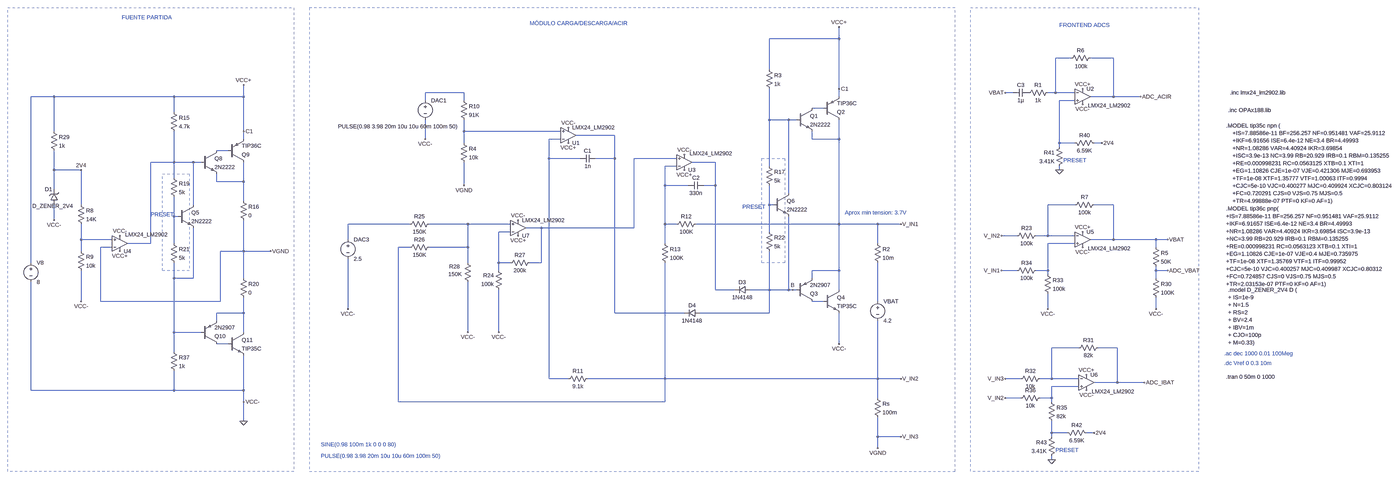
[diagram p0: schematic modulo_carga_descarga_ac_imp.asc, whole sheet]
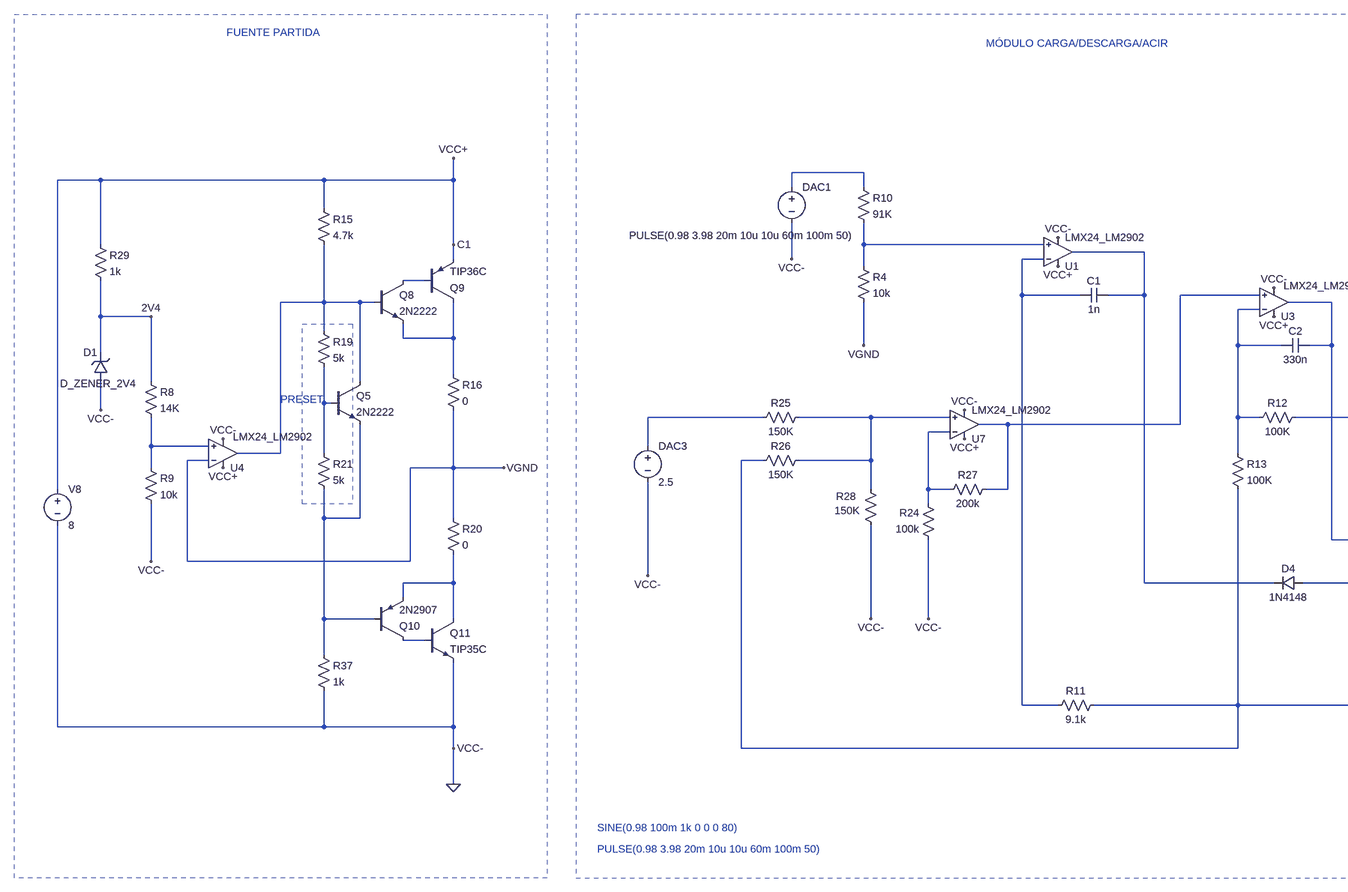
[diagram p1: schematic modulo_carga_descarga_ac_imp.asc, part, row 1 of 1, column 1 of 2]
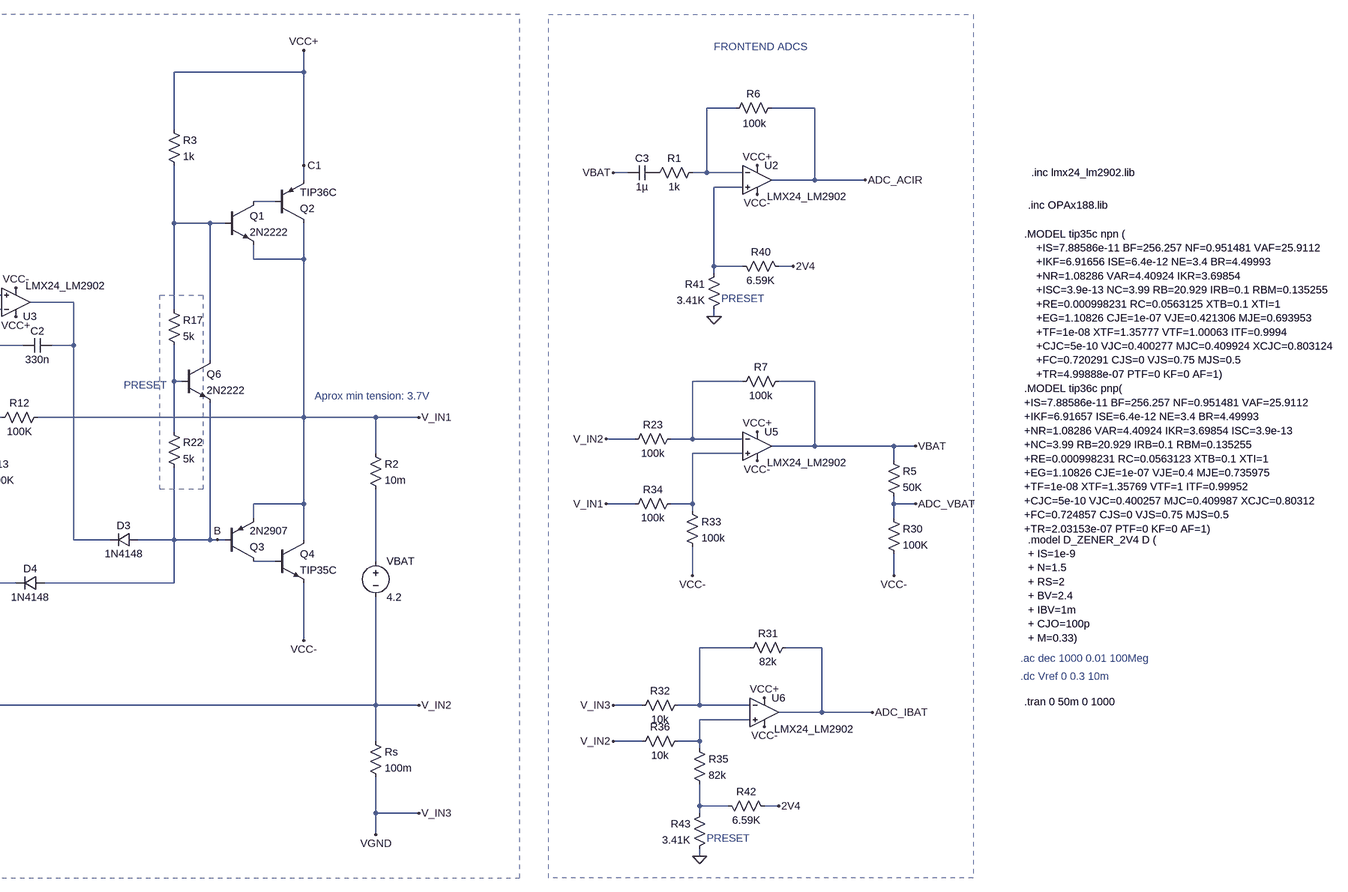
[diagram p2: schematic modulo_carga_descarga_ac_imp.asc, part, row 1 of 1, column 2 of 2]
modulo_carga_descarga_ac_imp.asc, the LTspice schematic file:
Version 4.1
SHEET 1 4748 1780
WIRE 1344 -1120 1344 -1168
WIRE 1344 -1120 1056 -1120
WIRE 2304 -1040 2240 -1040
WIRE 2480 -1040 2384 -1040
WIRE 1056 -992 1056 -1120
WIRE 1344 -912 1344 -1120
WIRE -208 -896 -368 -896
WIRE 2064 -896 2032 -896
WIRE 2240 -896 2240 -1040
WIRE 2240 -896 2208 -896
WIRE 2320 -896 2240 -896
WIRE -1904 -880 -2000 -880
WIRE -1408 -880 -1904 -880
WIRE -1120 -880 -1120 -928
WIRE -1120 -880 -1408 -880
WIRE 1344 -880 1344 -912
WIRE 2480 -880 2480 -1040
WIRE 2480 -880 2384 -880
WIRE 2592 -880 2480 -880
WIRE -368 -864 -368 -896
WIRE -208 -864 -208 -896
WIRE 2320 -864 2256 -864
WIRE 1280 -832 1232 -832
WIRE -1408 -816 -1408 -880
WIRE 1056 -784 1056 -912
WIRE 1136 -784 1056 -784
WIRE 1168 -784 1136 -784
WIRE -1904 -736 -1904 -880
WIRE -1120 -736 -1120 -880
WIRE -208 -736 -208 -784
WIRE 192 -736 -208 -736
WIRE 416 -720 256 -720
WIRE -1120 -704 -1120 -736
WIRE -368 -704 -368 -784
WIRE 192 -704 144 -704
WIRE 1232 -704 1232 -736
WIRE 1344 -704 1344 -784
WIRE 1344 -704 1232 -704
WIRE -208 -688 -208 -736
WIRE 2256 -688 2256 -864
WIRE 2320 -688 2256 -688
WIRE 2432 -688 2400 -688
WIRE 2256 -672 2256 -688
WIRE -1184 -656 -1232 -656
WIRE 144 -624 144 -704
WIRE 272 -624 144 -624
WIRE 416 -624 416 -720
WIRE 416 -624 336 -624
WIRE 672 -624 496 -624
WIRE -1408 -608 -1408 -736
WIRE -1408 -608 -1504 -608
WIRE -1328 -608 -1408 -608
WIRE -1296 -608 -1328 -608
WIRE 832 -608 736 -608
WIRE 672 -592 624 -592
WIRE 1056 -592 1056 -784
WIRE -1904 -576 -1904 -656
WIRE -1792 -576 -1904 -576
WIRE 2256 -576 2256 -592
WIRE -1408 -544 -1408 -608
WIRE -1232 -528 -1232 -560
WIRE -1120 -528 -1120 -608
WIRE -1120 -528 -1232 -528
WIRE -208 -512 -208 -608
WIRE 624 -512 624 -592
WIRE 720 -512 624 -512
WIRE 832 -512 832 -608
WIRE 832 -512 784 -512
WIRE -1904 -496 -1904 -576
WIRE 1136 -480 1136 -784
WIRE -1120 -448 -1120 -528
WIRE -1792 -432 -1792 -576
WIRE -1328 -432 -1328 -608
WIRE 1056 -432 1056 -512
WIRE 1072 -432 1056 -432
WIRE 2320 -432 2208 -432
WIRE 2480 -432 2400 -432
WIRE -1408 -384 -1408 -464
WIRE -1392 -384 -1408 -384
WIRE -1904 -368 -1904 -432
WIRE -432 -352 -688 -352
WIRE -192 -352 -352 -352
WIRE -16 -352 -192 -352
WIRE 624 -352 624 -512
WIRE 672 -352 624 -352
WIRE 1344 -352 1344 -704
WIRE 1344 -352 752 -352
WIRE 1504 -352 1344 -352
WIRE 1600 -352 1504 -352
WIRE 112 -336 48 -336
WIRE 496 -336 496 -624
WIRE 496 -336 112 -336
WIRE -16 -320 -64 -320
WIRE 1056 -320 1056 -432
WIRE 2080 -304 2016 -304
WIRE 2208 -304 2208 -432
WIRE 2208 -304 2160 -304
WIRE 2320 -304 2208 -304
WIRE -1792 -288 -1792 -352
WIRE -1664 -288 -1792 -288
WIRE -688 -288 -688 -352
WIRE 2480 -288 2480 -432
WIRE 2480 -288 2384 -288
WIRE 2656 -288 2480 -288
WIRE 2704 -288 2656 -288
WIRE -1504 -272 -1504 -608
WIRE -1504 -272 -1600 -272
WIRE -1408 -272 -1408 -384
WIRE 624 -272 624 -352
WIRE 1504 -272 1504 -352
WIRE 2320 -272 2208 -272
WIRE -1664 -256 -1712 -256
WIRE -432 -256 -480 -256
WIRE -192 -256 -192 -352
WIRE -192 -256 -352 -256
WIRE 2656 -256 2656 -288
WIRE -1792 -240 -1792 -288
WIRE -1120 -240 -1120 -368
WIRE -1120 -240 -1216 -240
WIRE -1008 -240 -1120 -240
WIRE -2000 -192 -2000 -880
WIRE -192 -192 -192 -256
WIRE -64 -192 -64 -320
WIRE -16 -192 -64 -192
WIRE 112 -192 112 -336
WIRE 112 -192 64 -192
WIRE -64 -160 -64 -192
WIRE 1344 -160 1344 -352
WIRE 1344 -160 1232 -160
WIRE 2080 -160 2016 -160
WIRE 2208 -160 2208 -272
WIRE 2208 -160 2160 -160
WIRE 2656 -160 2656 -176
WIRE 2704 -160 2656 -160
WIRE 2208 -144 2208 -160
WIRE -1408 -128 -1408 -192
WIRE -1328 -128 -1328 -336
WIRE -1328 -128 -1408 -128
WIRE -1120 -128 -1120 -240
WIRE 1232 -128 1232 -160
WIRE 2656 -128 2656 -160
WIRE 832 -80 832 -512
WIRE 912 -80 832 -80
WIRE 1056 -80 1056 -240
WIRE 1056 -80 976 -80
WIRE 1136 -80 1136 -384
WIRE 1136 -80 1056 -80
WIRE 1152 -80 1136 -80
WIRE 1168 -80 1152 -80
WIRE 1344 -80 1344 -160
WIRE -1792 -32 -1792 -160
WIRE -1712 -32 -1712 -256
WIRE -1216 -32 -1216 -240
WIRE -1216 -32 -1712 -32
WIRE 1280 -32 1232 -32
WIRE 1504 -32 1504 -192
WIRE -688 0 -688 -208
WIRE 2208 0 2208 -64
WIRE 2656 0 2656 -48
WIRE -1120 16 -1120 -48
WIRE -1120 16 -1232 16
WIRE 416 16 416 -624
WIRE 704 16 416 16
WIRE 1056 16 1056 -80
WIRE 1056 16 768 16
WIRE -1232 48 -1232 16
WIRE -1408 96 -1408 -128
WIRE -1296 96 -1408 96
WIRE -1120 96 -1120 16
WIRE -192 96 -192 -112
WIRE -64 96 -64 -80
WIRE -1184 144 -1232 144
WIRE 1344 144 1344 16
WIRE 2336 160 2224 160
WIRE 2496 160 2416 160
WIRE -1408 176 -1408 96
WIRE 144 288 144 -624
WIRE 224 288 144 288
WIRE 624 288 624 -192
WIRE 624 288 304 288
WIRE 1504 288 1504 48
WIRE 1504 288 624 288
WIRE 1600 288 1504 288
WIRE 2096 288 2032 288
WIRE 2224 288 2224 160
WIRE 2224 288 2176 288
WIRE 2336 288 2224 288
WIRE 2496 304 2496 160
WIRE 2496 304 2400 304
WIRE 2608 304 2496 304
WIRE 2336 320 2224 320
WIRE -2000 336 -2000 -112
WIRE -1408 336 -1408 256
WIRE -1408 336 -2000 336
WIRE -1120 336 -1120 192
WIRE -1120 336 -1408 336
WIRE 1504 368 1504 288
WIRE 2096 368 2032 368
WIRE 2224 368 2224 320
WIRE 2224 368 2176 368
WIRE -1120 384 -1120 336
WIRE -480 384 -480 -256
WIRE 624 384 624 288
WIRE 624 384 -480 384
WIRE 2224 384 2224 368
WIRE -1120 464 -1120 384
WIRE 2224 512 2224 464
WIRE 2288 512 2224 512
WIRE 2400 512 2368 512
WIRE 1504 528 1504 448
WIRE 1600 528 1504 528
WIRE 2224 528 2224 512
WIRE 1504 576 1504 528
WIRE 2224 624 2224 608
FLAG 224 -688 VCC+
FLAG 1344 -912 C1
FLAG 1152 -80 B
FLAG 224 -752 VCC-
FLAG 704 -576 VCC+
FLAG 704 -640 VCC-
FLAG 1344 -1168 VCC+
FLAG 1344 144 VCC-
FLAG 1504 576 VGND
FLAG -1120 -736 C1
FLAG -1120 -928 VCC+
FLAG -1120 384 VCC-
FLAG -1008 -240 VGND
FLAG -1120 464 0
FLAG -208 -512 VGND
FLAG -1632 -240 VCC+
FLAG -1632 -304 VCC-
FLAG -1792 -32 VCC-
FLAG -688 0 VCC-
FLAG 16 -304 VCC+
FLAG 16 -368 VCC-
FLAG -192 96 VCC-
FLAG -64 96 VCC-
FLAG 2352 -912 VCC+
FLAG 2352 -848 VCC-
FLAG 1600 -352 V_IN1
FLAG 1600 288 V_IN2
FLAG 1600 528 V_IN3
FLAG 2032 -896 VBAT
FLAG 2592 -880 ADC_ACIR
FLAG 2352 -320 VCC+
FLAG 2352 -256 VCC-
FLAG 2704 -288 VBAT
FLAG 2016 -304 V_IN2
FLAG 2208 0 VCC-
FLAG 2016 -160 V_IN1
FLAG 2368 272 VCC+
FLAG 2368 336 VCC-
FLAG 2608 304 ADC_IBAT
FLAG 2032 288 V_IN3
FLAG 2032 368 V_IN2
FLAG 2224 624 0
FLAG -1904 -368 VCC-
FLAG -368 -704 VCC-
FLAG 2656 0 VCC-
FLAG 2704 -160 ADC_VBAT
FLAG -1792 -576 2V4
FLAG 2400 512 2V4
FLAG 2256 -576 0
FLAG 2432 -688 2V4
SYMBOL res 1488 352 R0
SYMATTR InstName Rs
SYMATTR Value 100m
SYMBOL npn 1168 -832 R0
SYMATTR InstName Q1
SYMATTR Value 2N2222
SYMBOL pnp 1280 -784 M180
SYMATTR InstName Q2
SYMATTR Value TIP36C
SYMBOL pnp 1168 -32 M180
SYMATTR InstName Q3
SYMATTR Value 2N2907
SYMBOL npn 1280 -80 R0
SYMATTR InstName Q4
SYMATTR Value TIP35C
SYMBOL voltage 1504 -48 R0
WINDOW 123 0 0 Left 0
WINDOW 39 0 0 Left 0
SYMATTR InstName VBAT
SYMATTR Value 4.2
SYMBOL res -224 -704 R0
SYMATTR InstName R4
SYMATTR Value 10k
SYMBOL res -224 -880 R0
SYMATTR InstName R10
SYMATTR Value 91K
SYMBOL res 1040 -1008 R0
SYMATTR InstName R3
SYMATTR Value 1k
SYMBOL OpAmps\\opamp2 224 -656 M180
SYMATTR InstName U1
SYMATTR Value LMX24_LM2902
SYMBOL cap 336 -640 R90
WINDOW 0 0 32 VBottom 2
WINDOW 3 32 32 VTop 2
SYMATTR InstName C1
SYMATTR Value 1n
SYMBOL res 320 272 R90
WINDOW 0 0 56 VBottom 2
WINDOW 3 32 56 VTop 2
SYMATTR InstName R11
SYMATTR Value 9.1k
SYMBOL diode 976 -96 R90
WINDOW 0 0 32 VBottom 2
WINDOW 3 32 32 VTop 2
SYMATTR InstName D3
SYMATTR Value 1N4148
SYMBOL OpAmps\\opamp2 704 -544 M180
WINDOW 3 22 101 Left 2
SYMATTR Value LMX24_LM2902
SYMATTR InstName U3
SYMBOL cap 784 -528 R90
WINDOW 0 0 32 VBottom 2
WINDOW 3 32 32 VTop 2
SYMATTR InstName C2
SYMATTR Value 330n
SYMBOL voltage -688 -304 R0
WINDOW 123 0 0 Left 0
WINDOW 39 0 0 Left 0
SYMATTR InstName DAC3
SYMATTR Value 2.5
SYMBOL res 608 -288 R0
SYMATTR InstName R13
SYMATTR Value 100K
SYMBOL res 768 -368 R90
WINDOW 0 0 56 VBottom 2
WINDOW 3 32 56 VTop 2
SYMATTR InstName R12
SYMATTR Value 100K
SYMBOL diode 768 0 R90
WINDOW 0 0 32 VBottom 2
WINDOW 3 32 32 VTop 2
SYMATTR InstName D4
SYMATTR Value 1N4148
SYMBOL voltage -2000 -208 R0
WINDOW 123 0 0 Left 0
WINDOW 39 0 0 Left 0
SYMATTR InstName V8
SYMATTR Value 8
SYMBOL npn -1296 -656 R0
SYMATTR InstName Q8
SYMATTR Value 2N2222
SYMBOL pnp -1184 -608 M180
SYMATTR InstName Q9
SYMATTR Value TIP36C
SYMBOL pnp -1296 144 M180
SYMATTR InstName Q10
SYMATTR Value 2N2907
SYMBOL npn -1184 96 R0
SYMATTR InstName Q11
SYMATTR Value TIP35C
SYMBOL res -1136 -464 R0
SYMATTR InstName R16
SYMATTR Value 0
SYMBOL res -1136 -144 R0
SYMATTR InstName R20
SYMATTR Value 0
SYMBOL res 1488 -288 R0
SYMATTR InstName R2
SYMATTR Value 10m
SYMBOL voltage -368 -880 R0
WINDOW 3 -361 124 Left 2
WINDOW 123 0 0 Left 0
WINDOW 39 0 0 Left 0
SYMATTR Value PULSE(0.98 3.98 20m 10u 10u 60m 100m 50)
SYMATTR InstName DAC1
SYMBOL OpAmps\\opamp2 -1632 -208 M180
WINDOW 3 22 101 Left 2
SYMATTR Value LMX24_LM2902
SYMATTR InstName U4
SYMBOL res -1808 -256 R0
SYMATTR InstName R9
SYMATTR Value 10k
SYMBOL OpAmps\\opamp2 16 -272 M180
SYMATTR InstName U7
SYMATTR Value LMX24_LM2902
SYMBOL res -48 -64 R180
WINDOW 0 36 76 Left 2
WINDOW 3 36 40 Left 2
SYMATTR InstName R24
SYMATTR Value 100k
SYMBOL res -336 -368 R90
WINDOW 0 0 56 VBottom 2
WINDOW 3 32 56 VTop 2
SYMATTR InstName R25
SYMATTR Value 150K
SYMBOL res -336 -272 R90
WINDOW 0 0 56 VBottom 2
WINDOW 3 32 56 VTop 2
SYMATTR InstName R26
SYMATTR Value 150K
SYMBOL res 80 -208 R90
WINDOW 0 0 56 VBottom 2
WINDOW 3 32 56 VTop 2
SYMATTR InstName R27
SYMATTR Value 200k
SYMBOL res -208 -208 R0
WINDOW 0 -61 32 Left 2
WINDOW 3 -65 63 Left 2
SYMATTR InstName R28
SYMATTR Value 150K
SYMBOL npn -1392 -432 R0
SYMATTR InstName Q5
SYMATTR Value 2N2222
SYMBOL res -1424 -560 R0
SYMATTR InstName R19
SYMATTR Value 5k
SYMBOL res -1424 -288 R0
SYMATTR InstName R21
SYMATTR Value 5k
SYMBOL npn 1072 -480 R0
SYMATTR InstName Q6
SYMATTR Value 2N2222
SYMBOL res 1040 -608 R0
SYMATTR InstName R17
SYMATTR Value 5k
SYMBOL res 1040 -336 R0
SYMATTR InstName R22
SYMATTR Value 5k
SYMBOL OpAmps\\opamp2 2352 -944 R0
WINDOW 3 22 101 Left 2
SYMATTR Value LMX24_LM2902
SYMATTR InstName U2
SYMBOL cap 2128 -912 R90
WINDOW 0 0 32 VBottom 2
WINDOW 3 32 32 VTop 2
SYMATTR InstName C3
SYMATTR Value 1µ
SYMBOL res 2224 -912 R90
WINDOW 0 0 56 VBottom 2
WINDOW 3 32 56 VTop 2
SYMATTR InstName R1
SYMATTR Value 1k
SYMBOL res 2400 -1056 R90
WINDOW 0 0 56 VBottom 2
WINDOW 3 35 54 VTop 2
SYMATTR InstName R6
SYMATTR Value 100k
SYMBOL OpAmps\\opamp2 2352 -352 R0
WINDOW 3 22 101 Left 2
SYMATTR Value LMX24_LM2902
SYMATTR InstName U5
SYMBOL res 2416 -448 R90
WINDOW 0 0 56 VBottom 2
WINDOW 3 32 56 VTop 2
SYMATTR InstName R7
SYMATTR Value 100k
SYMBOL res 2176 -320 R90
WINDOW 0 0 56 VBottom 2
WINDOW 3 32 56 VTop 2
SYMATTR InstName R23
SYMATTR Value 100k
SYMBOL res 2192 -160 R0
SYMATTR InstName R33
SYMATTR Value 100k
SYMBOL res 2176 -176 R90
WINDOW 0 0 56 VBottom 2
WINDOW 3 32 56 VTop 2
SYMATTR InstName R34
SYMATTR Value 100k
SYMBOL OpAmps\\opamp2 2368 240 R0
WINDOW 3 22 101 Left 2
SYMATTR Value LMX24_LM2902
SYMATTR InstName U6
SYMBOL res 2432 144 R90
WINDOW 0 0 56 VBottom 2
WINDOW 3 32 56 VTop 2
SYMATTR InstName R31
SYMATTR Value 82k
SYMBOL res 2192 272 R90
WINDOW 0 0 56 VBottom 2
WINDOW 3 32 56 VTop 2
SYMATTR InstName R32
SYMATTR Value 10k
SYMBOL res 2208 368 R0
SYMATTR InstName R35
SYMATTR Value 82k
SYMBOL res 2192 352 R90
WINDOW 0 0 56 VBottom 2
WINDOW 3 32 56 VTop 2
SYMATTR InstName R36
SYMATTR Value 10k
SYMBOL res -1424 160 R0
SYMATTR InstName R37
SYMATTR Value 1k
SYMBOL res -1424 -832 R0
SYMATTR InstName R15
SYMATTR Value 4.7k
SYMBOL zener -1888 -432 R180
WINDOW 0 24 64 Left 2
WINDOW 3 -62 -5 Left 2
SYMATTR InstName D1
SYMATTR Value D_ZENER_2V4
SYMBOL res -1808 -448 R0
SYMATTR InstName R8
SYMATTR Value 14K
SYMBOL res -1920 -752 R0
SYMATTR InstName R29
SYMATTR Value 1k
SYMBOL res 2384 528 M270
WINDOW 0 32 56 VTop 2
WINDOW 3 0 56 VBottom 2
SYMATTR InstName R42
SYMATTR Value 6.59K
SYMBOL res 2240 512 M0
SYMATTR InstName R43
SYMATTR Value 3.41K
SYMBOL res 2640 -272 R0
SYMATTR InstName R5
SYMATTR Value 50K
SYMBOL res 2640 -144 R0
SYMATTR InstName R30
SYMATTR Value 100K
SYMBOL res 2416 -672 M270
WINDOW 0 32 56 VTop 2
WINDOW 3 0 56 VBottom 2
SYMATTR InstName R40
SYMATTR Value 6.59K
SYMBOL res 2272 -688 M0
SYMATTR InstName R41
SYMATTR Value 3.41K
TEXT 3304 280 Left 2 !.tran 0 50m 0 1000
TEXT 3296 184 Left 2 ;.ac dec 1000 0.01 100Meg
TEXT 3296 224 Left 2 ;.dc Vref 0 0.3 10m
TEXT 3304 -760 Left 2 !.MODEL tip35c npn (\n    +IS=7.88586e-11 BF=256.257 NF=0.951481 VAF=25.9112\n    +IKF=6.91656 ISE=6.4e-12 NE=3.4 BR=4.49993\n    +NR=1.08286 VAR=4.40924 IKR=3.69854\n    +ISC=3.9e-13 NC=3.99 RB=20.929 IRB=0.1 RBM=0.135255\n    +RE=0.000998231 RC=0.0563125 XTB=0.1 XTI=1\n    +EG=1.10826 CJE=1e-07 VJE=0.421306 MJE=0.693953\n    +TF=1e-08 XTF=1.35777 VTF=1.00063 ITF=0.9994\n    +CJC=5e-10 VJC=0.400277 MJC=0.409924 XCJC=0.803124\n    +FC=0.720291 CJS=0 VJS=0.75 MJS=0.5\n    +TR=4.99888e-07 PTF=0 KF=0 AF=1)
TEXT 3304 -416 Left 2 !.MODEL tip36c pnp(\n+IS=7.88586e-11 BF=256.257 NF=0.951481 VAF=25.9112\n+IKF=6.91657 ISE=6.4e-12 NE=3.4 BR=4.49993\n+NR=1.08286 VAR=4.40924 IKR=3.69854 ISC=3.9e-13\n+NC=3.99 RB=20.929 IRB=0.1 RBM=0.135255\n+RE=0.000998231 RC=0.0563123 XTB=0.1 XTI=1\n+EG=1.10826 CJE=1e-07 VJE=0.4 MJE=0.735975\n+TF=1e-08 XTF=1.35769 VTF=1 ITF=0.99952\n+CJC=5e-10 VJC=0.400257 MJC=0.409987 XCJC=0.80312\n+FC=0.724857 CJS=0 VJS=0.75 MJS=0.5\n+TR=2.03153e-07 PTF=0 KF=0 AF=1)
TEXT 3312 -824 Left 2 !.inc OPAx188.lib
TEXT 3312 -80 Left 2 !.model D_ZENER_2V4 D (\n+ IS=1e-9\n+ N=1.5\n+ RS=2\n+ BV=2.4\n+ IBV=1m\n+ CJO=100p\n+ M=0.33)
TEXT 3320 -896 Left 2 !.inc lmx24_lm2902.lib
TEXT -1624 -1208 Left 2 ;FUENTE PARTIDA
TEXT 64 -1184 Left 2 ;MÓDULO CARGA/DESCARGA/ACIR
TEXT -800 560 Left 2 ;SINE(0.98 100m 1k 0 0 0 80)
TEXT 2256 -1176 Left 2 ;FRONTEND ADCS
TEXT -800 608 Left 2 ;PULSE(0.98 3.98 20m 10u 10u 60m 100m 50)
TEXT 2240 584 Left 2 ;PRESET
TEXT 944 -424 Left 2 ;PRESET
TEXT -1504 -392 Left 2 ;PRESET
TEXT 1368 -400 Left 2 ;Aprox min tension: 3.7V
TEXT 2272 -616 Left 2 ;PRESET
RECTANGLE Normal -912 672 -2096 -1248 2
RECTANGLE Normal -848 672 1824 -1248 2
RECTANGLE Normal 2832 672 1888 -1248 2
RECTANGLE Normal 1120 -192 1024 -624 2
RECTANGLE Normal -1344 -160 -1456 -560 2

The netlist it stands for:
* modulo_carga_descarga_ac_imp.asc
Rs V_IN2 V_IN3 100m
Q1 N004 N005 V_IN1 0 2N2222
Q2 V_IN1 N004 C1 0 TIP36C
Q3 N024 B V_IN1 0 2N2907
Q4 V_IN1 N024 0 0 TIP35C
VBAT N025 V_IN2 4.2
R4 N006 V_IN3 10k
R10 N002 N006 91K
R3 C1 N005 1k
X§U1 N006 N008 C1 0 N007 LMX24_LM2902  ; pins In+ In- V+ V- OUT
C1 N007 N008 1n
R11 V_IN2 N008 9.1k
D3 B N012 1N4148
X§U3 N010 N013 C1 0 N012 LMX24_LM2902  ; pins In+ In- V+ V- OUT
C2 N012 N013 330n
V§DAC3 N018 0 2.5
R13 N013 V_IN2 100K
R12 V_IN1 N013 100K
D4 B N007 1N4148
V8 C1 0 8
Q8 N009 N011 N014 0 2N2222
Q9 N014 N009 C1 0 TIP36C
Q10 N027 N023 N026 0 2N2907
Q11 N026 N027 0 0 TIP35C
R16 N014 V_IN3 0
R20 V_IN3 N026 0
R2 V_IN1 N025 10m
V§DAC1 N002 0 PULSE(0.98 3.98 20m 10u 10u 60m 100m 50)
X§U4 N021 V_IN3 C1 0 N011 LMX24_LM2902  ; pins In+ In- V+ V- OUT
R9 N021 0 10k
X§U7 N019 N020 C1 0 N010 LMX24_LM2902  ; pins In+ In- V+ V- OUT
R24 0 N020 100k
R25 N019 N018 150K
R26 N019 V_IN2 150K
R27 N010 N020 200k
R28 N019 0 150K
Q5 N011 N017 N023 0 2N2222
R19 N011 N017 5k
R21 N017 N023 5k
Q6 N005 N015 B 0 2N2222
R17 N005 N015 5k
R22 N015 B 5k
X§U2 N003 N001 C1 0 ADC_ACIR LMX24_LM2902  ; pins In+ In- V+ V- OUT
C3 P001 VBAT 1µ
R1 N001 P001 1k
R6 ADC_ACIR N001 100k
X§U5 N022 N016 C1 0 VBAT LMX24_LM2902  ; pins In+ In- V+ V- OUT
R7 VBAT N016 100k
R23 N016 V_IN2 100k
R33 N022 0 100k
R34 N022 V_IN1 100k
X§U6 N029 N028 C1 0 ADC_IBAT LMX24_LM2902  ; pins In+ In- V+ V- OUT
R31 ADC_IBAT N028 82k
R32 N028 V_IN3 10k
R35 N029 N030 82k
R36 N029 V_IN2 10k
R37 N023 0 1k
R15 C1 N011 4.7k
D1 0 2V4 D_ZENER_2V4
R8 2V4 N021 14K
R29 C1 2V4 1k
R42 2V4 N030 6.59K
R43 N030 0 3.41K
R5 VBAT ADC_VBAT 50K
R30 ADC_VBAT 0 100K
R40 2V4 N003 6.59K
R41 N003 0 3.41K
.model D D
.lib standard.dio
.model NPN NPN
.model PNP PNP
.lib standard.bjt
.tran 0 50m 0 1000
* .ac dec 1000 0.01 100Meg
* .dc Vref 0 0.3 10m
.MODEL tip35c npn (
    +IS=7.88586e-11 BF=256.257 NF=0.951481 VAF=25.9112
    +IKF=6.91656 ISE=6.4e-12 NE=3.4 BR=4.49993
    +NR=1.08286 VAR=4.40924 IKR=3.69854
    +ISC=3.9e-13 NC=3.99 RB=20.929 IRB=0.1 RBM=0.135255
    +RE=0.000998231 RC=0.0563125 XTB=0.1 XTI=1
    +EG=1.10826 CJE=1e-07 VJE=0.421306 MJE=0.693953
    +TF=1e-08 XTF=1.35777 VTF=1.00063 ITF=0.9994
    +CJC=5e-10 VJC=0.400277 MJC=0.409924 XCJC=0.803124
    +FC=0.720291 CJS=0 VJS=0.75 MJS=0.5
    +TR=4.99888e-07 PTF=0 KF=0 AF=1)
.MODEL tip36c pnp(
+IS=7.88586e-11 BF=256.257 NF=0.951481 VAF=25.9112
+IKF=6.91657 ISE=6.4e-12 NE=3.4 BR=4.49993
+NR=1.08286 VAR=4.40924 IKR=3.69854 ISC=3.9e-13
+NC=3.99 RB=20.929 IRB=0.1 RBM=0.135255
+RE=0.000998231 RC=0.0563123 XTB=0.1 XTI=1
+EG=1.10826 CJE=1e-07 VJE=0.4 MJE=0.735975
+TF=1e-08 XTF=1.35769 VTF=1 ITF=0.99952
+CJC=5e-10 VJC=0.400257 MJC=0.409987 XCJC=0.80312
+FC=0.724857 CJS=0 VJS=0.75 MJS=0.5
+TR=2.03153e-07 PTF=0 KF=0 AF=1)
.inc OPAx188.lib
.model D_ZENER_2V4 D (
+ IS=1e-9
+ N=1.5
+ RS=2
+ BV=2.4
+ IBV=1m
+ CJO=100p
+ M=0.33)
.inc lmx24_lm2902.lib
* FUENTE PARTIDA
* MÓDULO CARGA/DESCARGA/ACIR
* SINE(0.98 100m 1k 0 0 0 80)
* FRONTEND ADCS
* PULSE(0.98 3.98 20m 10u 10u 60m 100m 50)
* PRESET
* PRESET
* PRESET
* Aprox min tension: 3.7V
* PRESET
.backanno
.end